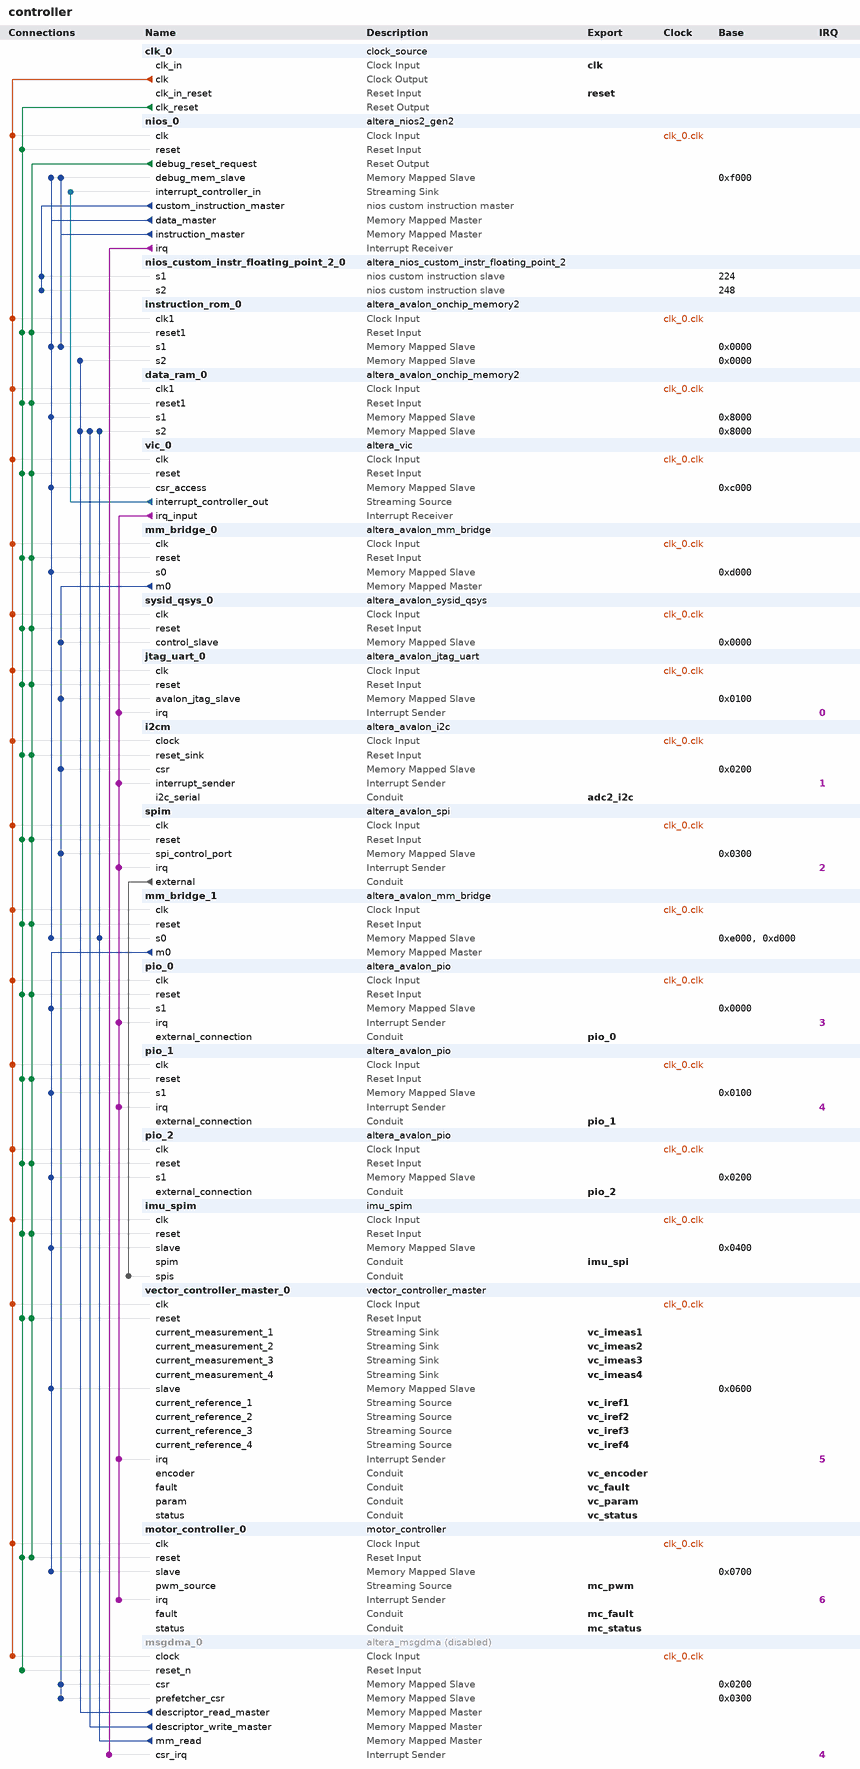
[diagram p0: system contents]
# Platform Designer (Qsys) system controller, Cyclone 10 LP 10CL025YU256C8G
# Parameters at their usual value, and those the tool derives, are not listed.
package require -exact qsys 20.1
create_system controller
set_project_property DEVICE_FAMILY {Cyclone 10 LP}
set_project_property DEVICE 10CL025YU256C8G

add_instance clk_0 clock_source 20.1
set_instance_parameter_value clk_0 clockFrequency 100000000
set_instance_parameter_value clk_0 resetSynchronousEdges DEASSERT

add_instance nios_0 altera_nios2_gen2 20.1
set_instance_parameter_value nios_0 dcache_size 0
set_instance_parameter_value nios_0 dividerType srt2
set_instance_parameter_value nios_0 exceptionSlave instruction_rom_0.s1
set_instance_parameter_value nios_0 icache_size 0
set_instance_parameter_value nios_0 impl Fast
set_instance_parameter_value nios_0 resetSlave instruction_rom_0.s1
set_instance_parameter_value nios_0 setting_branchpredictiontype Static
set_instance_parameter_value nios_0 setting_interruptControllerType External
set_instance_parameter_value nios_0 setting_shadowRegisterSets 1

add_instance nios_custom_instr_floating_point_2_0 altera_nios_custom_instr_floating_point_2 20.1
set_instance_parameter_value nios_custom_instr_floating_point_2_0 arithmetic_present true
set_instance_parameter_value nios_custom_instr_floating_point_2_0 comparison_present true
set_instance_parameter_value nios_custom_instr_floating_point_2_0 conversion_present true
set_instance_parameter_value nios_custom_instr_floating_point_2_0 root_present true

add_instance instruction_rom_0 altera_avalon_onchip_memory2 20.1
set_instance_parameter_value instruction_rom_0 dataWidth 32
set_instance_parameter_value instruction_rom_0 dualPort false
set_instance_parameter_value instruction_rom_0 initMemContent true
set_instance_parameter_value instruction_rom_0 initializationFileName onchip_mem.hex
set_instance_parameter_value instruction_rom_0 memorySize 32768
set_instance_parameter_value instruction_rom_0 writable false

add_instance data_ram_0 altera_avalon_onchip_memory2 20.1
set_instance_parameter_value data_ram_0 dataWidth 32
set_instance_parameter_value data_ram_0 dualPort false
set_instance_parameter_value data_ram_0 initMemContent true
set_instance_parameter_value data_ram_0 initializationFileName onchip_mem.hex
set_instance_parameter_value data_ram_0 memorySize 8192

add_instance vic_0 altera_vic 20.1
set_instance_parameter_value vic_0 DAISY_CHAIN_ENABLE 0
set_instance_parameter_value vic_0 INTERRUPT_LATENCY_CYCLES 2
set_instance_parameter_value vic_0 NUMBER_OF_INT_PORTS 8
set_instance_parameter_value vic_0 OVERRIDE_INTERRUPT_LATENCY false
set_instance_parameter_value vic_0 RIL_WIDTH 2

add_instance mm_bridge_0 altera_avalon_mm_bridge 20.1
set_instance_parameter_value mm_bridge_0 ADDRESS_UNITS SYMBOLS
set_instance_parameter_value mm_bridge_0 ADDRESS_WIDTH 12
set_instance_parameter_value mm_bridge_0 DATA_WIDTH 32
set_instance_parameter_value mm_bridge_0 MAX_PENDING_RESPONSES 4
set_instance_parameter_value mm_bridge_0 USE_AUTO_ADDRESS_WIDTH 0

add_instance sysid_qsys_0 altera_avalon_sysid_qsys 20.1
set_instance_parameter_value sysid_qsys_0 id -889275714

add_instance jtag_uart_0 altera_avalon_jtag_uart 20.1
set_instance_parameter_value jtag_uart_0 simInteractiveOptions NO_INTERACTIVE_WINDOWS

add_instance i2cm altera_avalon_i2c 20.1
set_instance_parameter_value i2cm FIFO_DEPTH 4

add_instance spim altera_avalon_spi 20.1
set_instance_parameter_value spim clockPolarity 0
set_instance_parameter_value spim dataWidth 8
set_instance_parameter_value spim masterSPI true
set_instance_parameter_value spim numberOfSlaves 1
set_instance_parameter_value spim targetClockRate 12500000

add_instance mm_bridge_1 altera_avalon_mm_bridge 20.1
set_instance_parameter_value mm_bridge_1 ADDRESS_UNITS SYMBOLS
set_instance_parameter_value mm_bridge_1 ADDRESS_WIDTH 12
set_instance_parameter_value mm_bridge_1 DATA_WIDTH 32
set_instance_parameter_value mm_bridge_1 MAX_PENDING_RESPONSES 4
set_instance_parameter_value mm_bridge_1 USE_AUTO_ADDRESS_WIDTH 0

add_instance pio_0 altera_avalon_pio 20.1
set_instance_parameter_value pio_0 bitClearingEdgeCapReg true
set_instance_parameter_value pio_0 captureEdge true
set_instance_parameter_value pio_0 direction Input
set_instance_parameter_value pio_0 generateIRQ true
set_instance_parameter_value pio_0 irqType EDGE
set_instance_parameter_value pio_0 simDoTestBenchWiring true
set_instance_parameter_value pio_0 width 1

add_instance pio_1 altera_avalon_pio 20.1
set_instance_parameter_value pio_1 bitClearingEdgeCapReg true
set_instance_parameter_value pio_1 direction Input
set_instance_parameter_value pio_1 edgeType FALLING
set_instance_parameter_value pio_1 generateIRQ true
set_instance_parameter_value pio_1 simDoTestBenchWiring true
set_instance_parameter_value pio_1 simDrivenValue 4294967295
set_instance_parameter_value pio_1 width 32

add_instance pio_2 altera_avalon_pio 20.1
set_instance_parameter_value pio_2 bitModifyingOutReg true
set_instance_parameter_value pio_2 direction Output
set_instance_parameter_value pio_2 width 11

add_instance imu_spim imu_spim 1.0

add_instance vector_controller_master_0 vector_controller_master 1.0

add_instance motor_controller_0 motor_controller 1.0

add_instance msgdma_0 altera_msgdma 20.1
set_instance_property msgdma_0 ENABLED false
set_instance_parameter_value msgdma_0 BURST_ENABLE 0
set_instance_parameter_value msgdma_0 CHANNEL_ENABLE 1
set_instance_parameter_value msgdma_0 DATA_FIFO_DEPTH 32
set_instance_parameter_value msgdma_0 DATA_WIDTH 16
set_instance_parameter_value msgdma_0 DESCRIPTOR_FIFO_DEPTH 128
set_instance_parameter_value msgdma_0 ENHANCED_FEATURES 0
set_instance_parameter_value msgdma_0 ERROR_ENABLE 0
set_instance_parameter_value msgdma_0 MAX_BURST_COUNT 2
set_instance_parameter_value msgdma_0 MAX_BYTE 1024
set_instance_parameter_value msgdma_0 MODE 1
set_instance_parameter_value msgdma_0 PACKET_ENABLE 0
set_instance_parameter_value msgdma_0 PREFETCHER_ENABLE 1
set_instance_parameter_value msgdma_0 TRANSFER_TYPE {Aligned Accesses}

# connections
add_connection clk_0.clk data_ram_0.clk1 clock
add_connection clk_0.clk i2cm.clock clock
add_connection clk_0.clk imu_spim.clk clock
add_connection clk_0.clk instruction_rom_0.clk1 clock
add_connection clk_0.clk jtag_uart_0.clk clock
add_connection clk_0.clk mm_bridge_0.clk clock
add_connection clk_0.clk mm_bridge_1.clk clock
add_connection clk_0.clk motor_controller_0.clk clock
add_connection clk_0.clk msgdma_0.clock clock
add_connection clk_0.clk nios_0.clk clock
add_connection clk_0.clk pio_0.clk clock
add_connection clk_0.clk pio_1.clk clock
add_connection clk_0.clk pio_2.clk clock
add_connection clk_0.clk spim.clk clock
add_connection clk_0.clk sysid_qsys_0.clk clock
add_connection clk_0.clk vector_controller_master_0.clk clock
add_connection clk_0.clk vic_0.clk clock
add_connection clk_0.clk_reset data_ram_0.reset1 reset
add_connection clk_0.clk_reset i2cm.reset_sink reset
add_connection clk_0.clk_reset imu_spim.reset reset
add_connection clk_0.clk_reset instruction_rom_0.reset1 reset
add_connection clk_0.clk_reset jtag_uart_0.reset reset
add_connection clk_0.clk_reset mm_bridge_0.reset reset
add_connection clk_0.clk_reset mm_bridge_1.reset reset
add_connection clk_0.clk_reset motor_controller_0.reset reset
add_connection clk_0.clk_reset msgdma_0.reset_n reset
add_connection clk_0.clk_reset nios_0.reset reset
add_connection clk_0.clk_reset pio_0.reset reset
add_connection clk_0.clk_reset pio_1.reset reset
add_connection clk_0.clk_reset pio_2.reset reset
add_connection clk_0.clk_reset spim.reset reset
add_connection clk_0.clk_reset sysid_qsys_0.reset reset
add_connection clk_0.clk_reset vector_controller_master_0.reset reset
add_connection clk_0.clk_reset vic_0.reset reset
add_connection nios_0.debug_reset_request data_ram_0.reset1 reset
add_connection nios_0.debug_reset_request i2cm.reset_sink reset
add_connection nios_0.debug_reset_request imu_spim.reset reset
add_connection nios_0.debug_reset_request instruction_rom_0.reset1 reset
add_connection nios_0.debug_reset_request jtag_uart_0.reset reset
add_connection nios_0.debug_reset_request mm_bridge_0.reset reset
add_connection nios_0.debug_reset_request mm_bridge_1.reset reset
add_connection nios_0.debug_reset_request motor_controller_0.reset reset
add_connection nios_0.debug_reset_request pio_0.reset reset
add_connection nios_0.debug_reset_request pio_1.reset reset
add_connection nios_0.debug_reset_request pio_2.reset reset
add_connection nios_0.debug_reset_request spim.reset reset
add_connection nios_0.debug_reset_request sysid_qsys_0.reset reset
add_connection nios_0.debug_reset_request vector_controller_master_0.reset reset
add_connection nios_0.debug_reset_request vic_0.reset reset
add_connection mm_bridge_0.m0 i2cm.csr avalon
set_connection_parameter_value mm_bridge_0.m0/i2cm.csr baseAddress 0x0200
add_connection mm_bridge_0.m0 jtag_uart_0.avalon_jtag_slave avalon
set_connection_parameter_value mm_bridge_0.m0/jtag_uart_0.avalon_jtag_slave baseAddress 0x0100
add_connection mm_bridge_0.m0 msgdma_0.csr avalon
set_connection_parameter_value mm_bridge_0.m0/msgdma_0.csr baseAddress 0x0200
add_connection mm_bridge_0.m0 msgdma_0.prefetcher_csr avalon
set_connection_parameter_value mm_bridge_0.m0/msgdma_0.prefetcher_csr baseAddress 0x0300
add_connection mm_bridge_0.m0 spim.spi_control_port avalon
set_connection_parameter_value mm_bridge_0.m0/spim.spi_control_port baseAddress 0x0300
add_connection mm_bridge_0.m0 sysid_qsys_0.control_slave avalon
set_connection_parameter_value mm_bridge_0.m0/sysid_qsys_0.control_slave baseAddress 0x0000
add_connection mm_bridge_1.m0 imu_spim.slave avalon
set_connection_parameter_value mm_bridge_1.m0/imu_spim.slave baseAddress 0x0400
add_connection mm_bridge_1.m0 motor_controller_0.slave avalon
set_connection_parameter_value mm_bridge_1.m0/motor_controller_0.slave baseAddress 0x0700
add_connection mm_bridge_1.m0 pio_0.s1 avalon
set_connection_parameter_value mm_bridge_1.m0/pio_0.s1 baseAddress 0x0000
add_connection mm_bridge_1.m0 pio_1.s1 avalon
set_connection_parameter_value mm_bridge_1.m0/pio_1.s1 baseAddress 0x0100
add_connection mm_bridge_1.m0 pio_2.s1 avalon
set_connection_parameter_value mm_bridge_1.m0/pio_2.s1 baseAddress 0x0200
add_connection mm_bridge_1.m0 vector_controller_master_0.slave avalon
set_connection_parameter_value mm_bridge_1.m0/vector_controller_master_0.slave baseAddress 0x0600
add_connection msgdma_0.descriptor_read_master data_ram_0.s2 avalon
set_connection_parameter_value msgdma_0.descriptor_read_master/data_ram_0.s2 baseAddress 0x8000
add_connection msgdma_0.descriptor_read_master instruction_rom_0.s2 avalon
set_connection_parameter_value msgdma_0.descriptor_read_master/instruction_rom_0.s2 baseAddress 0x0000
add_connection msgdma_0.descriptor_write_master data_ram_0.s2 avalon
set_connection_parameter_value msgdma_0.descriptor_write_master/data_ram_0.s2 baseAddress 0x8000
add_connection msgdma_0.mm_read data_ram_0.s2 avalon
set_connection_parameter_value msgdma_0.mm_read/data_ram_0.s2 baseAddress 0x8000
add_connection msgdma_0.mm_read mm_bridge_1.s0 avalon
set_connection_parameter_value msgdma_0.mm_read/mm_bridge_1.s0 baseAddress 0xd000
add_connection nios_0.data_master data_ram_0.s1 avalon
set_connection_parameter_value nios_0.data_master/data_ram_0.s1 baseAddress 0x8000
add_connection nios_0.data_master instruction_rom_0.s1 avalon
set_connection_parameter_value nios_0.data_master/instruction_rom_0.s1 baseAddress 0x0000
add_connection nios_0.data_master mm_bridge_0.s0 avalon
set_connection_parameter_value nios_0.data_master/mm_bridge_0.s0 baseAddress 0xd000
add_connection nios_0.data_master mm_bridge_1.s0 avalon
set_connection_parameter_value nios_0.data_master/mm_bridge_1.s0 baseAddress 0xe000
add_connection nios_0.data_master nios_0.debug_mem_slave avalon
set_connection_parameter_value nios_0.data_master/nios_0.debug_mem_slave baseAddress 0xf000
add_connection nios_0.data_master vic_0.csr_access avalon
set_connection_parameter_value nios_0.data_master/vic_0.csr_access baseAddress 0xc000
add_connection nios_0.instruction_master instruction_rom_0.s1 avalon
set_connection_parameter_value nios_0.instruction_master/instruction_rom_0.s1 baseAddress 0x0000
add_connection nios_0.instruction_master nios_0.debug_mem_slave avalon
set_connection_parameter_value nios_0.instruction_master/nios_0.debug_mem_slave baseAddress 0xf000
add_connection vic_0.interrupt_controller_out nios_0.interrupt_controller_in avalon_streaming
add_connection spim.external imu_spim.spis conduit
add_connection nios_0.irq msgdma_0.csr_irq interrupt
set_connection_parameter_value nios_0.irq/msgdma_0.csr_irq irqNumber 4
add_connection vic_0.irq_input i2cm.interrupt_sender interrupt
set_connection_parameter_value vic_0.irq_input/i2cm.interrupt_sender irqNumber 1
add_connection vic_0.irq_input jtag_uart_0.irq interrupt
set_connection_parameter_value vic_0.irq_input/jtag_uart_0.irq irqNumber 0
add_connection vic_0.irq_input motor_controller_0.irq interrupt
set_connection_parameter_value vic_0.irq_input/motor_controller_0.irq irqNumber 6
add_connection vic_0.irq_input pio_0.irq interrupt
set_connection_parameter_value vic_0.irq_input/pio_0.irq irqNumber 3
add_connection vic_0.irq_input pio_1.irq interrupt
set_connection_parameter_value vic_0.irq_input/pio_1.irq irqNumber 4
add_connection vic_0.irq_input spim.irq interrupt
set_connection_parameter_value vic_0.irq_input/spim.irq irqNumber 2
add_connection vic_0.irq_input vector_controller_master_0.irq interrupt
set_connection_parameter_value vic_0.irq_input/vector_controller_master_0.irq irqNumber 5
add_connection nios_0.custom_instruction_master nios_custom_instr_floating_point_2_0.s1 nios_custom_instruction
set_connection_parameter_value nios_0.custom_instruction_master/nios_custom_instr_floating_point_2_0.s1 CIName nios_custom_instr_floating_point_2_0
set_connection_parameter_value nios_0.custom_instruction_master/nios_custom_instr_floating_point_2_0.s1 baseAddress 224
add_connection nios_0.custom_instruction_master nios_custom_instr_floating_point_2_0.s2 nios_custom_instruction
set_connection_parameter_value nios_0.custom_instruction_master/nios_custom_instr_floating_point_2_0.s2 CIName nios_custom_instr_floating_point_2_0_1
set_connection_parameter_value nios_0.custom_instruction_master/nios_custom_instr_floating_point_2_0.s2 baseAddress 248

# exported interfaces
add_interface adc2_i2c conduit end
set_interface_property adc2_i2c EXPORT_OF i2cm.i2c_serial
add_interface clk clock sink
set_interface_property clk EXPORT_OF clk_0.clk_in
add_interface imu_spi conduit end
set_interface_property imu_spi EXPORT_OF imu_spim.spim
add_interface mc_fault conduit end
set_interface_property mc_fault EXPORT_OF motor_controller_0.fault
add_interface mc_pwm avalon_streaming source
set_interface_property mc_pwm EXPORT_OF motor_controller_0.pwm_source
add_interface mc_status conduit end
set_interface_property mc_status EXPORT_OF motor_controller_0.status
add_interface pio_0 conduit end
set_interface_property pio_0 EXPORT_OF pio_0.external_connection
add_interface pio_1 conduit end
set_interface_property pio_1 EXPORT_OF pio_1.external_connection
add_interface pio_2 conduit end
set_interface_property pio_2 EXPORT_OF pio_2.external_connection
add_interface reset reset sink
set_interface_property reset EXPORT_OF clk_0.clk_in_reset
add_interface vc_encoder conduit end
set_interface_property vc_encoder EXPORT_OF vector_controller_master_0.encoder
add_interface vc_fault conduit end
set_interface_property vc_fault EXPORT_OF vector_controller_master_0.fault
add_interface vc_imeas1 avalon_streaming sink
set_interface_property vc_imeas1 EXPORT_OF vector_controller_master_0.current_measurement_1
add_interface vc_imeas2 avalon_streaming sink
set_interface_property vc_imeas2 EXPORT_OF vector_controller_master_0.current_measurement_2
add_interface vc_imeas3 avalon_streaming sink
set_interface_property vc_imeas3 EXPORT_OF vector_controller_master_0.current_measurement_3
add_interface vc_imeas4 avalon_streaming sink
set_interface_property vc_imeas4 EXPORT_OF vector_controller_master_0.current_measurement_4
add_interface vc_iref1 avalon_streaming source
set_interface_property vc_iref1 EXPORT_OF vector_controller_master_0.current_reference_1
add_interface vc_iref2 avalon_streaming source
set_interface_property vc_iref2 EXPORT_OF vector_controller_master_0.current_reference_2
add_interface vc_iref3 avalon_streaming source
set_interface_property vc_iref3 EXPORT_OF vector_controller_master_0.current_reference_3
add_interface vc_iref4 avalon_streaming source
set_interface_property vc_iref4 EXPORT_OF vector_controller_master_0.current_reference_4
add_interface vc_param conduit end
set_interface_property vc_param EXPORT_OF vector_controller_master_0.param
add_interface vc_status conduit end
set_interface_property vc_status EXPORT_OF vector_controller_master_0.status

set_interconnect_requirement {$system} qsys_mm.clockCrossingAdapter HANDSHAKE
set_interconnect_requirement {$system} qsys_mm.enableEccProtection FALSE
set_interconnect_requirement {$system} qsys_mm.insertDefaultSlave FALSE
set_interconnect_requirement {$system} qsys_mm.maxAdditionalLatency 1

save_system controller.qsys
